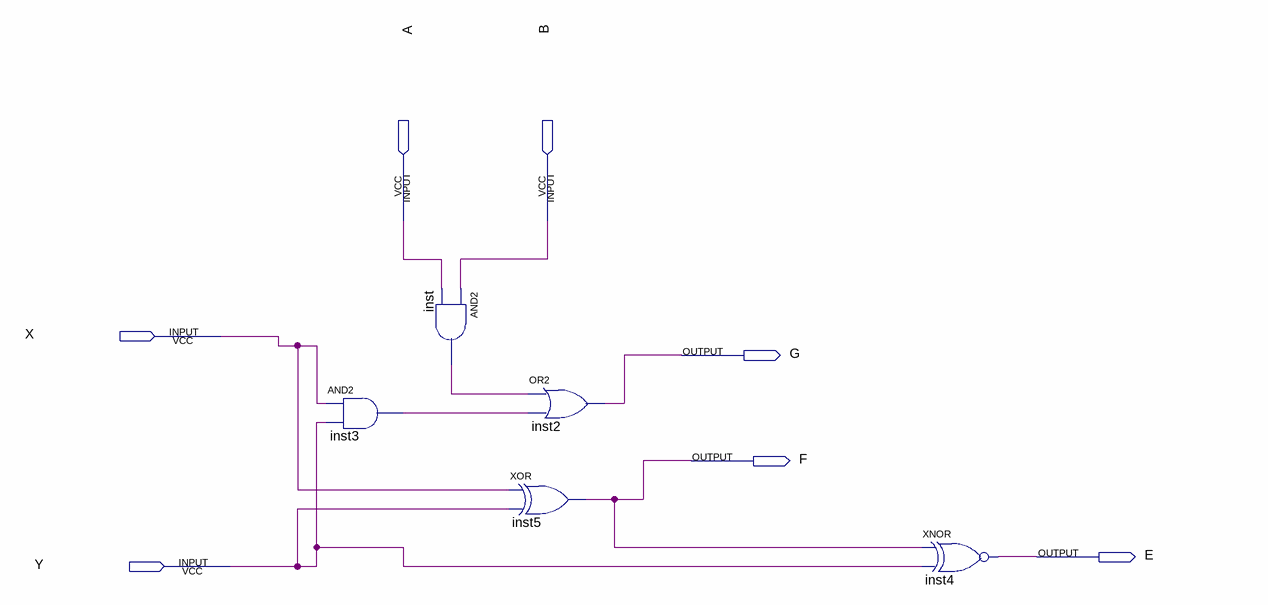
[diagram p0: schematic sheet]
// Quartus schematic Task2_GFE.bdf as structural Verilog: 5 symbols, 7 pins
module Task2_GFE (
  input  A,
  input  B,
  input  X,
  input  Y,
  output G,
  output F,
  output E
);

  wire inst3_out, inst_out;

  and inst3 (inst3_out, X, Y);
  and inst (inst_out, B, A);
  xor inst5 (F, X, Y);
  or inst2 (G, inst_out, inst3_out);
  xnor inst4 (E, F, Y);
endmodule
